# Altium schematic sheet LPCB226 - TOP OVERVIEW.SchDoc
size A3; Address1: Factory 10; Address2: 9-13 Dingley Avenue, Dandeong, VICTORIA 3175, AUSTRALIA; Revision: 1; SheetNumber: 1; SheetTotal: 1; Lockie__PCB_SUB_ASSEMBLY: Top Overview; Lockie__PCB_ASSEMBLY: Pack Module; Lockie__LDL: LPCB226; Lockie__PCB_DESCRIPTION: Battery Pack Module
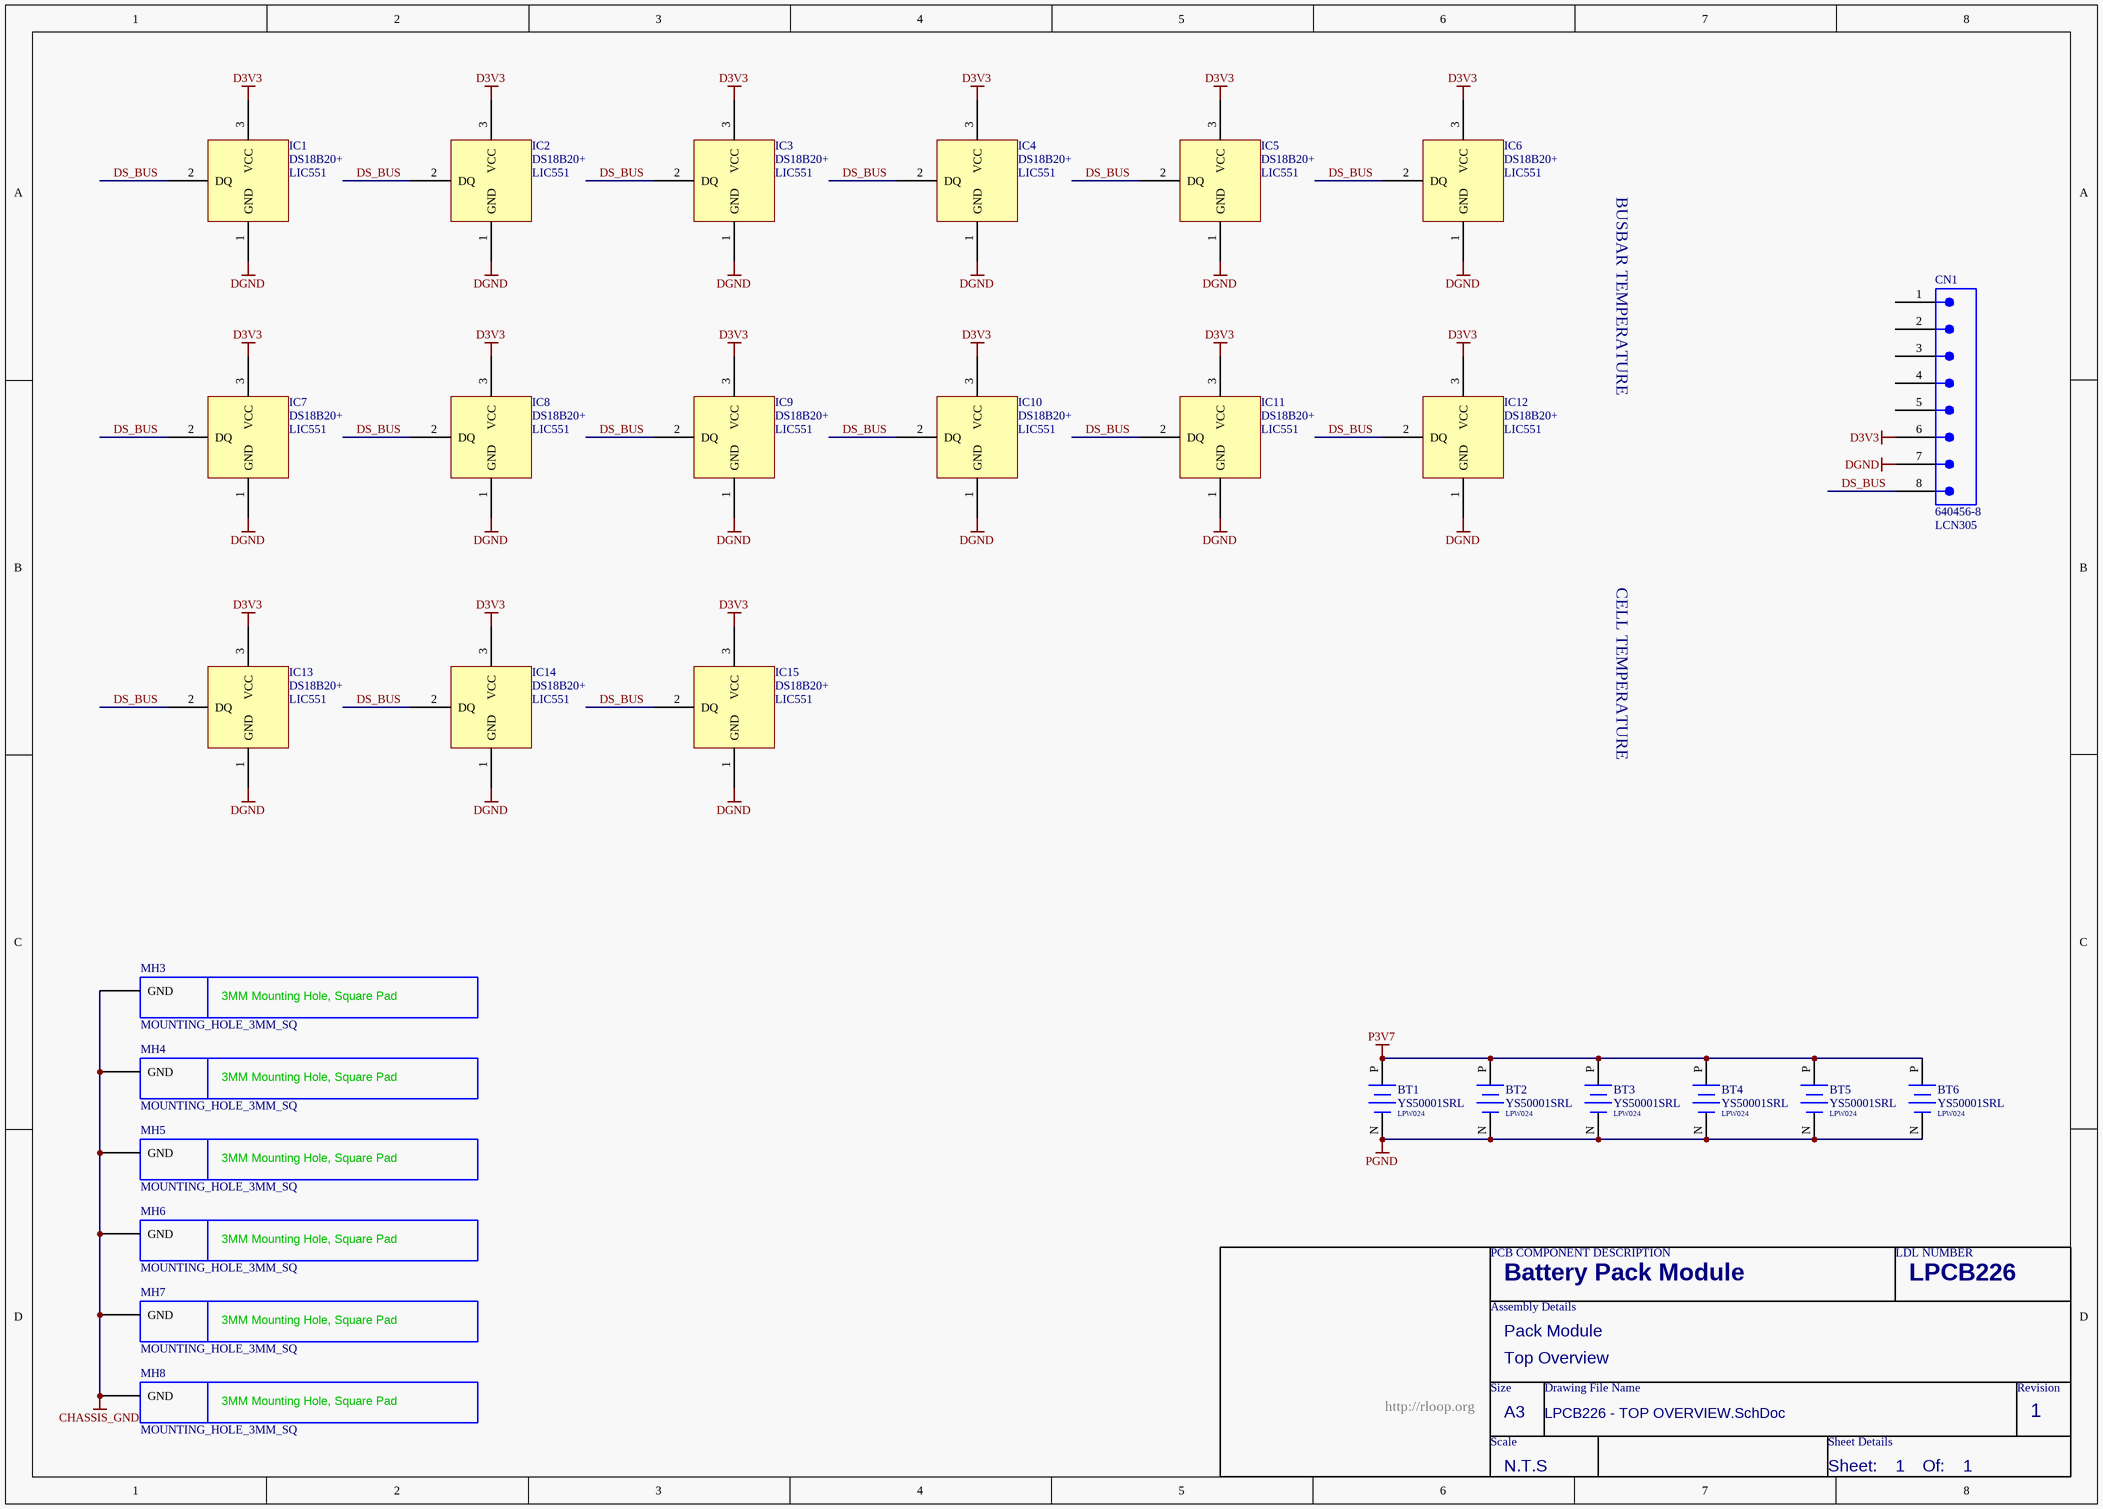
[diagram p0: LPCB226 - TOP OVERVIEW.SchDoc]

## Parts
BT1  YS50001SRL  LDL_NUMBER: LPW024  [YS50001SRL]
BT2  YS50001SRL  LDL_NUMBER: LPW024  [YS50001SRL]
BT3  YS50001SRL  LDL_NUMBER: LPW024  [YS50001SRL]
BT4  YS50001SRL  LDL_NUMBER: LPW024  [YS50001SRL]
BT5  YS50001SRL  LDL_NUMBER: LPW024  [YS50001SRL]
BT6  YS50001SRL  LDL_NUMBER: LPW024  [YS50001SRL]
CN1  640456-8  LDL_NUMBER: LCN305  [640456-8]
IC1  DS18B20+  LDL_NUMBER: LIC551  [TO-92A]
IC2  DS18B20+  LDL_NUMBER: LIC551  [TO-92A]
IC3  DS18B20+  LDL_NUMBER: LIC551  [TO-92A]
IC4  DS18B20+  LDL_NUMBER: LIC551  [TO-92A]
IC5  DS18B20+  LDL_NUMBER: LIC551  [TO-92A]
IC6  DS18B20+  LDL_NUMBER: LIC551  [TO-92A]
IC7  DS18B20+  LDL_NUMBER: LIC551  [TO-92A]
IC8  DS18B20+  LDL_NUMBER: LIC551  [TO-92A]
IC9  DS18B20+  LDL_NUMBER: LIC551  [TO-92A]
IC10  DS18B20+  LDL_NUMBER: LIC551  [TO-92A]
IC11  DS18B20+  LDL_NUMBER: LIC551  [TO-92A]
IC12  DS18B20+  LDL_NUMBER: LIC551  [TO-92A]
IC13  DS18B20+  LDL_NUMBER: LIC551  [TO-92A]
IC14  DS18B20+  LDL_NUMBER: LIC551  [TO-92A]
IC15  DS18B20+  LDL_NUMBER: LIC551  [TO-92A]
MH3  MOUNTING_HOLE_3MM_SQ  [MOUNTING_HOLE_3MM_SQ]  (no BOM)
MH4  MOUNTING_HOLE_3MM_SQ  [MOUNTING_HOLE_3MM_SQ]  (no BOM)
MH5  MOUNTING_HOLE_3MM_SQ  [MOUNTING_HOLE_3MM_SQ]  (no BOM)
MH6  MOUNTING_HOLE_3MM_SQ  [MOUNTING_HOLE_3MM_SQ]  (no BOM)
MH7  MOUNTING_HOLE_3MM_SQ  [MOUNTING_HOLE_3MM_SQ]  (no BOM)
MH8  MOUNTING_HOLE_3MM_SQ  [MOUNTING_HOLE_3MM_SQ]  (no BOM)

## Nets
CHASSIS_GND: MH3.MOUNT(GND) MH4.MOUNT(GND) MH5.MOUNT(GND) MH6.MOUNT(GND) MH7.MOUNT(GND) MH8.MOUNT(GND)
D3V3: CN1.6 IC1.3(VCC) IC2.3(VCC) IC3.3(VCC) IC4.3(VCC) IC5.3(VCC) IC6.3(VCC) IC7.3(VCC) IC8.3(VCC) IC9.3(VCC) IC10.3(VCC) IC11.3(VCC) IC12.3(VCC) IC13.3(VCC) IC14.3(VCC) IC15.3(VCC)
DGND: CN1.7 IC1.1(GND) IC2.1(GND) IC3.1(GND) IC4.1(GND) IC5.1(GND) IC6.1(GND) IC7.1(GND) IC8.1(GND) IC9.1(GND) IC10.1(GND) IC11.1(GND) IC12.1(GND) IC13.1(GND) IC14.1(GND) IC15.1(GND)
P3V7: BT1.P(+) BT2.P(+) BT3.P(+) BT4.P(+) BT5.P(+) BT6.P(+)
PGND: BT1.N(-) BT2.N(-) BT3.N(-) BT4.N(-) BT5.N(-) BT6.N(-)
DS_BUS: CN1.8 IC1.2(DQ) IC2.2(DQ) IC3.2(DQ) IC4.2(DQ) IC5.2(DQ) IC6.2(DQ) IC7.2(DQ) IC8.2(DQ) IC9.2(DQ) IC10.2(DQ) IC11.2(DQ) IC12.2(DQ) IC13.2(DQ) IC14.2(DQ) IC15.2(DQ)

Not connected (* = marked no-connect by the designer): CN1 1 2 3 4 5

## Notes on the sheet
- BUSBAR TEMPERATURE
- CELL TEMPERATURE
- PCB COMPONENT DESCRIPTION
- LDL NUMBER
- Assembly Details
- Size
- Drawing File Name
- Revision
- http://rloop.org
- Scale
- A3
- Sheet Details
- N.T.S
- Sheet:
- Of:
- (in symbol MOUNTING_HOLE_3MM_SQ) 3MM Mounting Hole, Square Pad

## Library data of the parts
BT1-BT6 = YS50001SRL: Battery, LiPo; Revision: July-2002: Re-released for DXP Platform.
CN1 = 640456-8: Connector, Male Header, 8 Way; FMEDA__CHANNEL: COM; FMEDA__OPERATING__CURRENT_MAX: 0; FMEDA__OPERATING__TEMP_MAX: 50; FMEDA__OPERATING__TEMP_MIN: -20; FMEDA__OPERATING__TEMP_TYP: 27; FMEDA__OPERATING__VOLTAGE_MAX: 16; FMEDA__OPERATING__VOLTAGE_TYP: 12; FMEDA__FUNCTION_IN_SYSTEM: *; FMEDA__OPERATING__CURRENT_MIN: 0; FMEDA__OPERATING__CURRENT_TYP: 0; FMEDA__OPERATING__VOLTAGE_MIN: 0
IC1-IC15 = DS18B20+: IC, Temperature Sensor, 1 Wire, PTH
MH3-MH8 = MOUNTING_HOLE_3MM_SQ: 3MM Mouting Hole, Square; FMEDA__CHANNEL: DIAG; FMEDA__FUNCTION_IN_SYSTEM: *